# EAGLE design rtc_module (EAGLE 9.6.1)
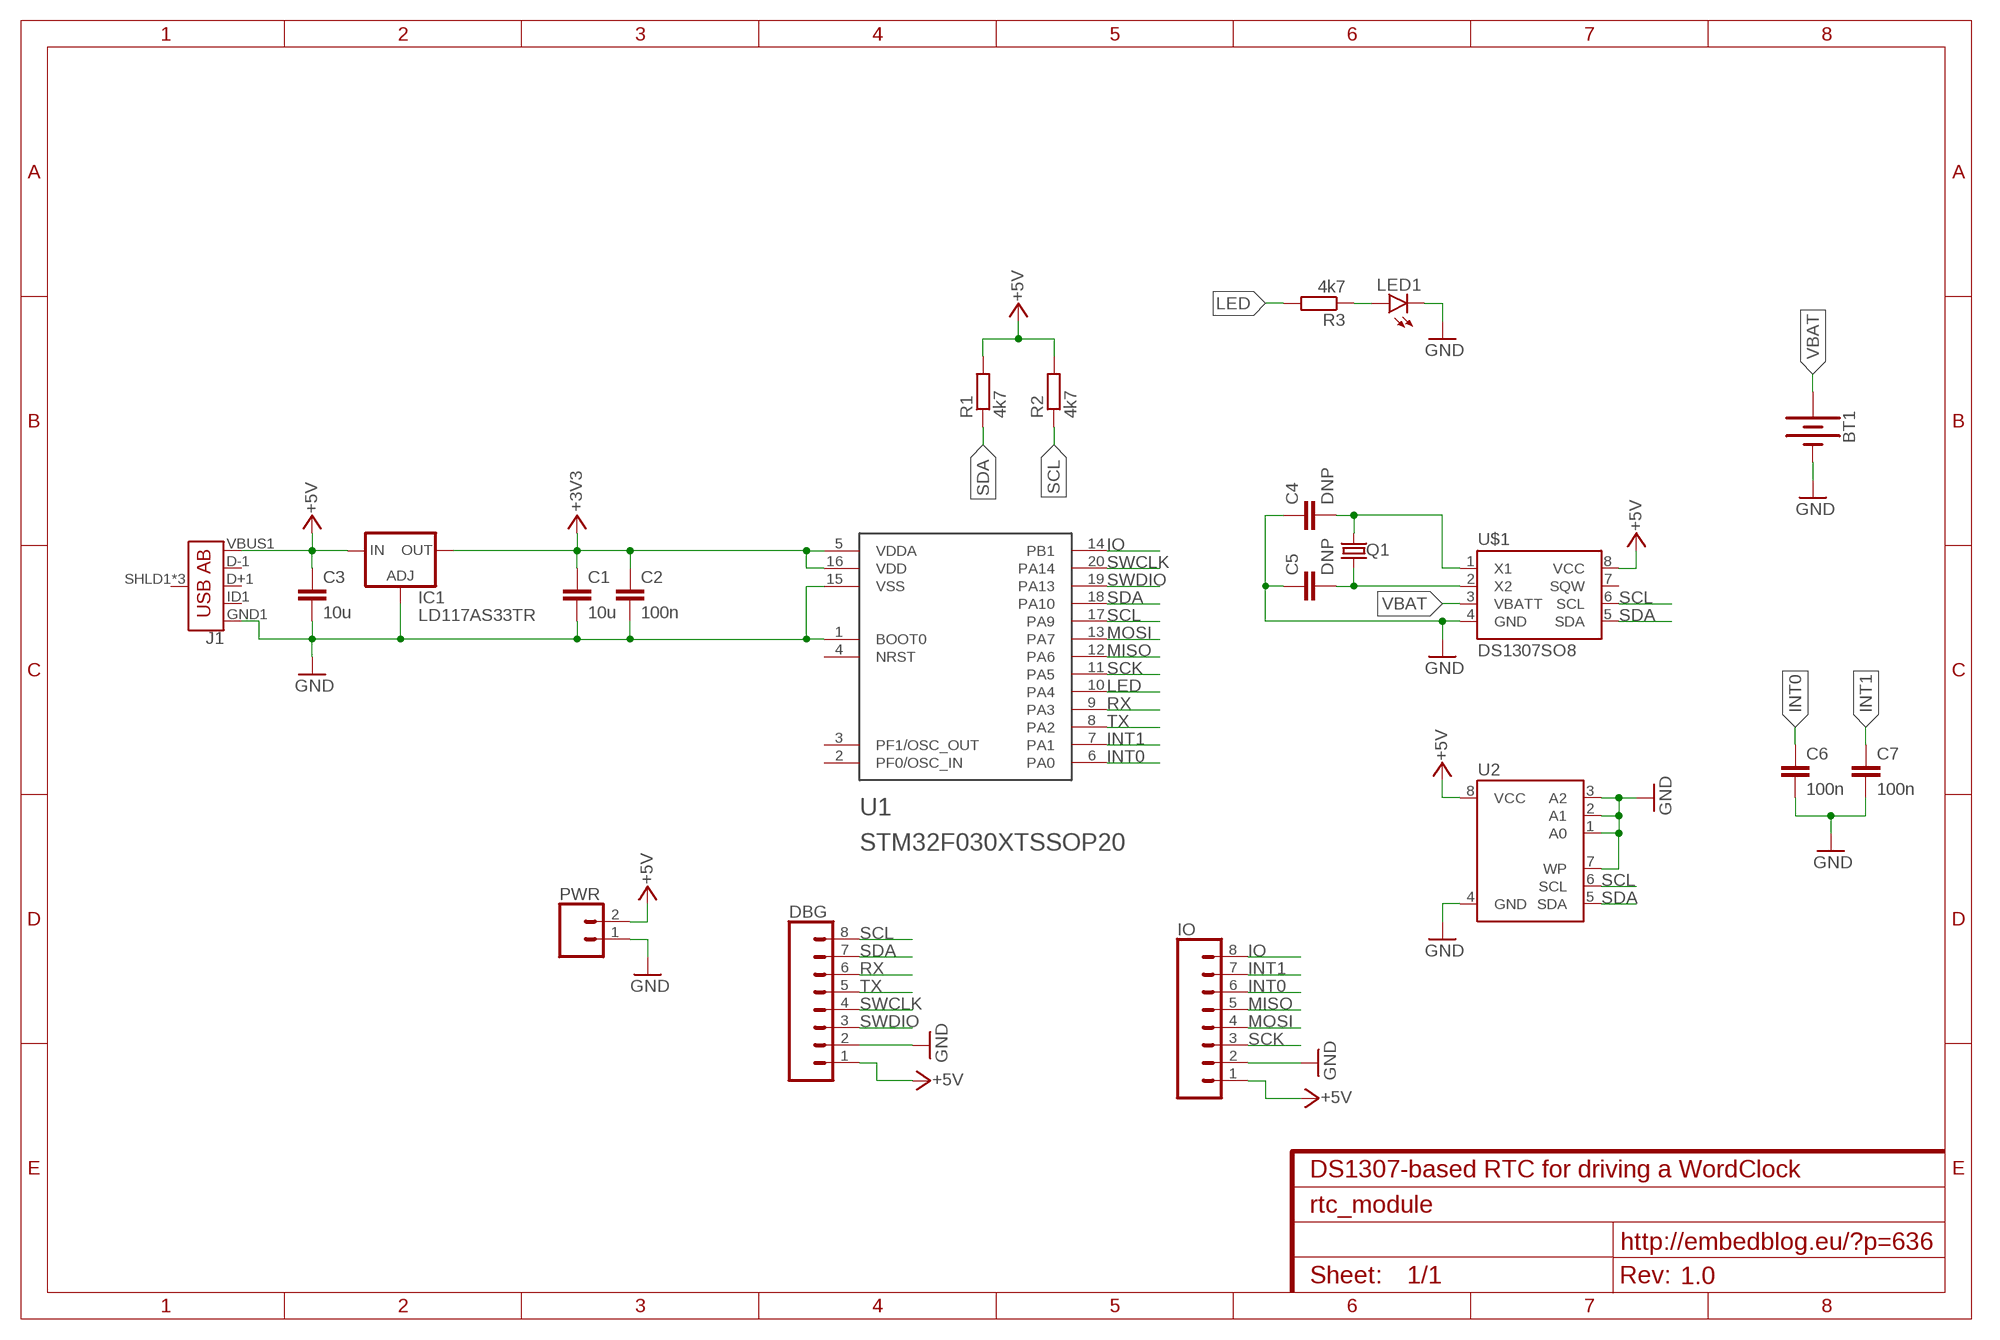
[diagram p0: schematic, sheet 1]
FRAME1 (FRAME-A4L): CNAME: DS1307-based RTC for driving a WordClock; CREVISION: 1.0

## Parts
BT1  BATTERY-20MM_PTH  [BATTCOM_20MM_PTH]
C1  10u  C-EUC1206  [C1206]
C2  100n  C-EUC1206  [C1206]
C3  10u  C-EUC1206  [C1206]
C4  DNP  C-EUC1206  [C1206]
C5  DNP  C-EUC1206  [C1206]
C6  100n  C-EUC1206  [C1206]
C7  100n  C-EUC1206  [C1206]
DBG  CONN_08"  [1X08]
IC1  LD117AS33TR  [SOT223]
IO  CONN_08"  [1X08]
J1  USB_AB_SMT  [USB-AB-MICRO-SMD]
LED1  LEDCHIPLED_1206  [CHIPLED_1206]
PWR  CONN_02PTH3  [1X02_LONGPADS]
Q1  CRYSTALTC38H  [TC38H]
R1  4k7  R-EU_R1206  [R1206]
R2  4k7  R-EU_R1206  [R1206]
R3  4k7  R-EU_R1206  [R1206]
U1  STM32F030XTSSOP20  [TSSOP-20]
U2  24LCXX  [SOIC8]
U$1  DS1307SO8  [SO08]

## Nets
+3V3: C1.1 C2.1 IC1.4(OUT) U1.5(VDDA) U1.16(VDD)
+5V: C3.1 DBG.1 IC1.3(IN) IO.1 J1.VBUS1(VBUS) PWR.2 R1.2 R2.2 U2.8(VCC) U$1.8(VCC)
GND: BT1.2(-) C1.2 C2.2 C3.2 C4.1 C5.1 C6.2 C7.2 DBG.2 IC1.1(ADJ) IO.2 J1.GND1(GND) LED1.C PWR.1 U1.1(BOOT0) U1.15(VSS) U2.1(A0) U2.2(A1) U2.3(A2) U2.4(GND) U2.7(WP) U$1.4(GND)
INT0: C6.1 IO.6 U1.6(PA0)
INT1: C7.1 IO.7 U1.7(PA1)
IO: IO.8 U1.14(PB1)
LED: R3.2 U1.10(PA4)
MISO: IO.5 U1.12(PA6)
MOSI: IO.4 U1.13(PA7)
N$1: C5.2 Q1.1 U$1.2(X2)
N$2: C4.2 Q1.2 U$1.1(X1)
N$4: LED1.A R3.1
RX: DBG.6 U1.9(PA3)
SCK: IO.3 U1.11(PA5)
SCL: DBG.8 R2.1 U1.17(PA9) U2.6(SCL) U$1.6(SCL)
SDA: DBG.7 R1.1 U1.18(PA10) U2.5(SDA) U$1.5(SDA)
SWCLK: DBG.4 U1.20(PA14)
SWDIO: DBG.3 U1.19(PA13)
TX: DBG.5 U1.8(PA2)
VBAT: BT1.1(+) U$1.3(VBATT)
Unconnected: J1.D+1(D+) J1.D-1(D-) J1.ID1(USBID) J1.SHLD1(SHIELD) J1.SHLD2(SHIELD) J1.SHLD3(SHIELD) U1.2(PF0/OSC_IN) U1.3(PF1/OSC_OUT) U1.4(NRST) U$1.7(SQW)

## Notes on the sheet
- http://embedblog.eu/?p=636

## Library data of the parts
BT1 = SparkFun-Batteries:BATTERY: Battery - Single Cell A variety of battery chemistries, sizes, and footprints. Device List: 20MM_PTH - Coin Cell Battery Holder - 20mm (PTH) <https://www.sparkfun.com/products/783> 20MM_PTH_KIT- Coin Cell battery Holder - 20 mm (PTH) <http://www.sparkfun.com/products/783>kit version with special mask 6.8MM_PTH - Coin Cell Battery Holder - 6.8MM(SMD) <https://www.digikey.com/product-detail/en/seiko-instruments/MS621FE-FL11E/728-1057-ND/1889208?WT.srch=1&gclid=CNOQ5a6LzdQCFZS2wAodXCkE0g> 12MM_SMD - Coin Cell Battery Holder - 12mm (SMD) <https://www.sparkfun.com/products/10592> 12MM_PTH - Coin Cell Battery Holder - 12mm (PTH) <https://www.sparkfun.com/products/7948> 20MM_SMD - 20mm Coin Cell Battery Holder (SMD) (2 legs) Used on the Big Time Watch Kit <https://www.sparkfun.com/products/11734> 20MM_SMD_4LEGS - Coin Cell Battery Holder - 20mm (SMD) <https://www.sparkfun.com/products/11892> 20MM_SMD_4LEGS_OVERPASTE - Coin Cell Battery Holder - 20mm (SMD) <https://www.sparkfun.com/products/11892> (Over-paste on the legs) 24.5MM_PTH - Coin Cell Battery Holder - 24.5mm (PTH) <https://www.sparkfun.com/products/8863> 9V - 9V Battery Holder - PC Mount Used on the SparkFun SparkPunk Sound Kit <https://www.sparkfun.com/products/11177> and SparkFun SparkPunk Sequencer Kit <https://www.sparkfun.com/products/12707> 18650 - Battery Holder - 18650 (PTH) <https://www.sparkfun.com/products/13113> AA - Battery Holder - 1xAA (PTH) <https://www.sparkfun.com/products/7949> AAA - Battery Holder - 1xAAA (PTH) <https://www.sparkfun.com/products/12718> AA_KIT - Battery Holder - 1xAA (PTH) <https://www.sparkfun.com/products/7949> Special kit package - pads only have exposed copper on one side of the board. AAA_KIT - Battery Holder - 1xAAA (PTH) <https://www.sparkfun.com/products/12718> Special kit package - pads only have exposed copper on one side of the board.; PROD_ID: BATT-09031; SF_SKU: PRT-00783
C1-C7 = resistor:C-EU: CAPACITOR, European symbol
DBG IO = SparkFun-Connectors:CONN_08: Multi connection point. Often used as Generic Header-pin footprint for 0.1 inch spaced/style header connections On any of the 0.1 inch spaced packages, you can populate with these: Break Away Headers - Straight <https://www.sparkfun.com/products/116> (PRT-00116) Break Away Male Headers - Right Angle <https://www.sparkfun.com/products/553> (PRT-00553) Female Headers <https://www.sparkfun.com/products/115> (PRT-00115) Break Away Headers - Machine Pin <https://www.sparkfun.com/products/117> (PRT-00117) Break Away Female Headers - Swiss Machine Pin <https://www.sparkfun.com/products/743> (PRT-00743) Arduino Stackable Header - 8 Pin <https://www.sparkfun.com/products/9279> (PRT-09279) For SCREWTERMINALS and SPRING TERMINALS visit here: Screw Terimnals on SparkFun.com <https://www.sparkfun.com/search/results?term=Screw+Terminals> (5mm/3.5mm/2.54mm spacing) This device is also useful as a general connection point to wire up your design to another part of your project. Our various solder wires solder well into these plated through hole pads. Hook-Up Wire - Assortment (Stranded, 22 AWG) <https://www.sparkfun.com/products/11375> (PRT-11375) Hook-Up Wire - Assortment (Solid Core, 22 AWG) <https://www.sparkfun.com/products/11367> (PRT-11367) View the entire wire category on our website here <https://www.sparkfun.com/categories/141> Special notes: Molex polarized connector foot print use with SKU : PRT-08231 with associated crimp pins and housings. 1MM SMD Version SKU: PRT-10208 NOTES ON THE VARIANTS LOCK and LOCK_LONGPADS... This footprint was designed to help hold the alignment of a through-hole component (i.e. 6-pin header) while soldering it into place. You may notice that each hole has been shifted either up or down by 0.005 of an inch from it's more standard position (which is a perfectly straight line). This slight alteration caused the pins (the squares in the middle) to touch the edges of the holes. Because they are alternating, it causes a "brace" to hold the component in place. 0.005 has proven to be the perfect amount of "off-center" position when using our standard breakaway headers. Although looks a little odd when you look at the bare footprint, once you have a header in there, the alteration is very hard to notice. Also,if you push a header all the way into place, it is covered up entirely on the bottom side.; PROD_ID: CONN-08438
IC1 = v-reg:LD117A?*: Low drop fixed and adjustable positive voltage regulators 1 A Source: http://www.st.com/stonline/products/literature/ds/7194/ld1117axx.pdf
J1 = SparkFun-Connectors:USB_AB: USB Type AB Micro Connector OTG-compatible. 5 pins, 3 shield pins SparkFun Products: IOIO-OTG <https://www.sparkfun.com/products/13613> SparkFun SAMD21 Mini Breakout <https://www.sparkfun.com/products/13664>; PROD_ID: CONN-11794
LED1 = led:LED: LED OSRAM: - CHIPLED LG R971, LG N971, LY N971, LG Q971, LY Q971, LO R971, LY R971 LH N974, LH R974 LS Q976, LO Q976, LY Q976 LO Q996 - Hyper CHIPLED LW Q18S LB Q993, LB Q99A, LB R99A - SideLED LS A670, LO A670, LY A670, LG A670, LP A670 LB A673, LV A673, LT A673, LW A673 LH A674 LY A675 LS A676, LA A676, LO A676, LY A676, LW A676 LS A679, LY A679, LG A679 - Hyper Micro SIDELED® LS Y876, LA Y876, LO Y876, LY Y876 LT Y87S - SmartLED LW L88C, LW L88S LB L89C, LB L89S, LG L890 LS L89K, LO L89K, LY L89K LS L896, LA L896, LO L896, LY L896 - TOPLED LS T670, LO T670, LY T670, LG T670, LP T670 LSG T670, LSP T670, LSY T670, LOP T670, LYG T670 LG T671, LOG T671, LSG T671 LB T673, LV T673, LT T673, LW T673 LH T674 LS T676, LA T676, LO T676, LY T676, LB T676, LH T676, LSB T676, LW T676 LB T67C, LV T67C, LT T67C, LS T67K, LO T67K, LY T67K, LW E67C LS E67B, LA E67B, LO E67B, LY E67B, LB E67C, LV E67C, LT E67C LW T67C LS T679, LY T679, LG T679 LS T770, LO T770, LY T770, LG T770, LP T770 LB T773, LV T773, LT T773, LW T773 LH T774 LS E675, LA E675, LY E675, LS T675 LS T776, LA T776, LO T776, LY T776, LB T776 LHGB T686 LT T68C, LB T68C - Hyper Mini TOPLED® LB M676 - Mini TOPLED Santana® LG M470 LS M47K, LO M47K, LY M47K Source: http://www.osram.convergy.de LUXEON: - LUMILED® LXK2-PW12-R00, LXK2-PW12-S00, LXK2-PW14-U00, LXK2-PW14-V00 LXK2-PM12-R00, LXK2-PM12-S00, LXK2-PM14-U00 LXK2-PE12-Q00, LXK2-PE12-R00, LXK2-PE12-S00, LXK2-PE14-T00, LXK2-PE14-U00 LXK2-PB12-K00, LXK2-PB12-L00, LXK2-PB12-M00, LXK2-PB14-N00, LXK2-PB14-P00, LXK2-PB14-Q00 LXK2-PR12-L00, LXK2-PR12-M00, LXK2-PR14-Q00, LXK2-PR14-R00 LXK2-PD12-Q00, LXK2-PD12-R00, LXK2-PD12-S00 LXK2-PH12-R00, LXK2-PH12-S00 LXK2-PL12-P00, LXK2-PL12-Q00, LXK2-PL12-R00 Source: www.luxeon.com KINGBRIGHT: KA-3528ASYC Source: www.kingbright.com
PWR = SparkFun-Connectors:CONN_02: Multi connection point. Often used as Generic Header-pin footprint for 0.1 inch spaced/style header connections On any of the 0.1 inch spaced packages, you can populate with these: Break Away Headers - Straight <https://www.sparkfun.com/products/116> (PRT-00116) Break Away Male Headers - Right Angle <https://www.sparkfun.com/products/553> (PRT-00553) Female Headers <https://www.sparkfun.com/products/115> (PRT-00115) Break Away Headers - Machine Pin <https://www.sparkfun.com/products/117> (PRT-00117) Break Away Female Headers - Swiss Machine Pin <https://www.sparkfun.com/products/743> (PRT-00743) For SCREWTERMINALS and SPRING TERMINALS visit here: Screw Terimnals on SparkFun.com <https://www.sparkfun.com/search/results?term=Screw+Terminals> (5mm/3.5mm/2.54mm spacing) This device is also useful as a general connection point to wire up your design to another part of your project. Our various solder wires solder well into these plated through hole pads. Hook-Up Wire - Assortment (Stranded, 22 AWG) <https://www.sparkfun.com/products/11375> (PRT-11375) Hook-Up Wire - Assortment (Solid Core, 22 AWG) <https://www.sparkfun.com/products/11367> (PRT-11367) View the entire wire category on our website here <https://www.sparkfun.com/categories/141> Special notes: Molex polarized connector foot print use with: PRT-08233 with associated crimp pins and housings. 2.54_SCREWTERM for use with PRT-10571. 3.5mm Screw Terminal footprints for PRT-08084 5mm Screw Terminal footprints for use with PRT-08432
Q1 = crystal:CRYSTAL: CRYSTAL; OC_FARNELL: unknown; OC_NEWARK: unknown
R1-R3 = resistor:R-EU_: RESISTOR, European symbol
U1 = stm32f030x:STM32F030X
U2 = m-pad-2.1:24LCXX: Serial I2C bus eeprom
U$1 = SparkFun-FreqCtrl:DS1307: I2C real-time clock with battery backup.

## Board
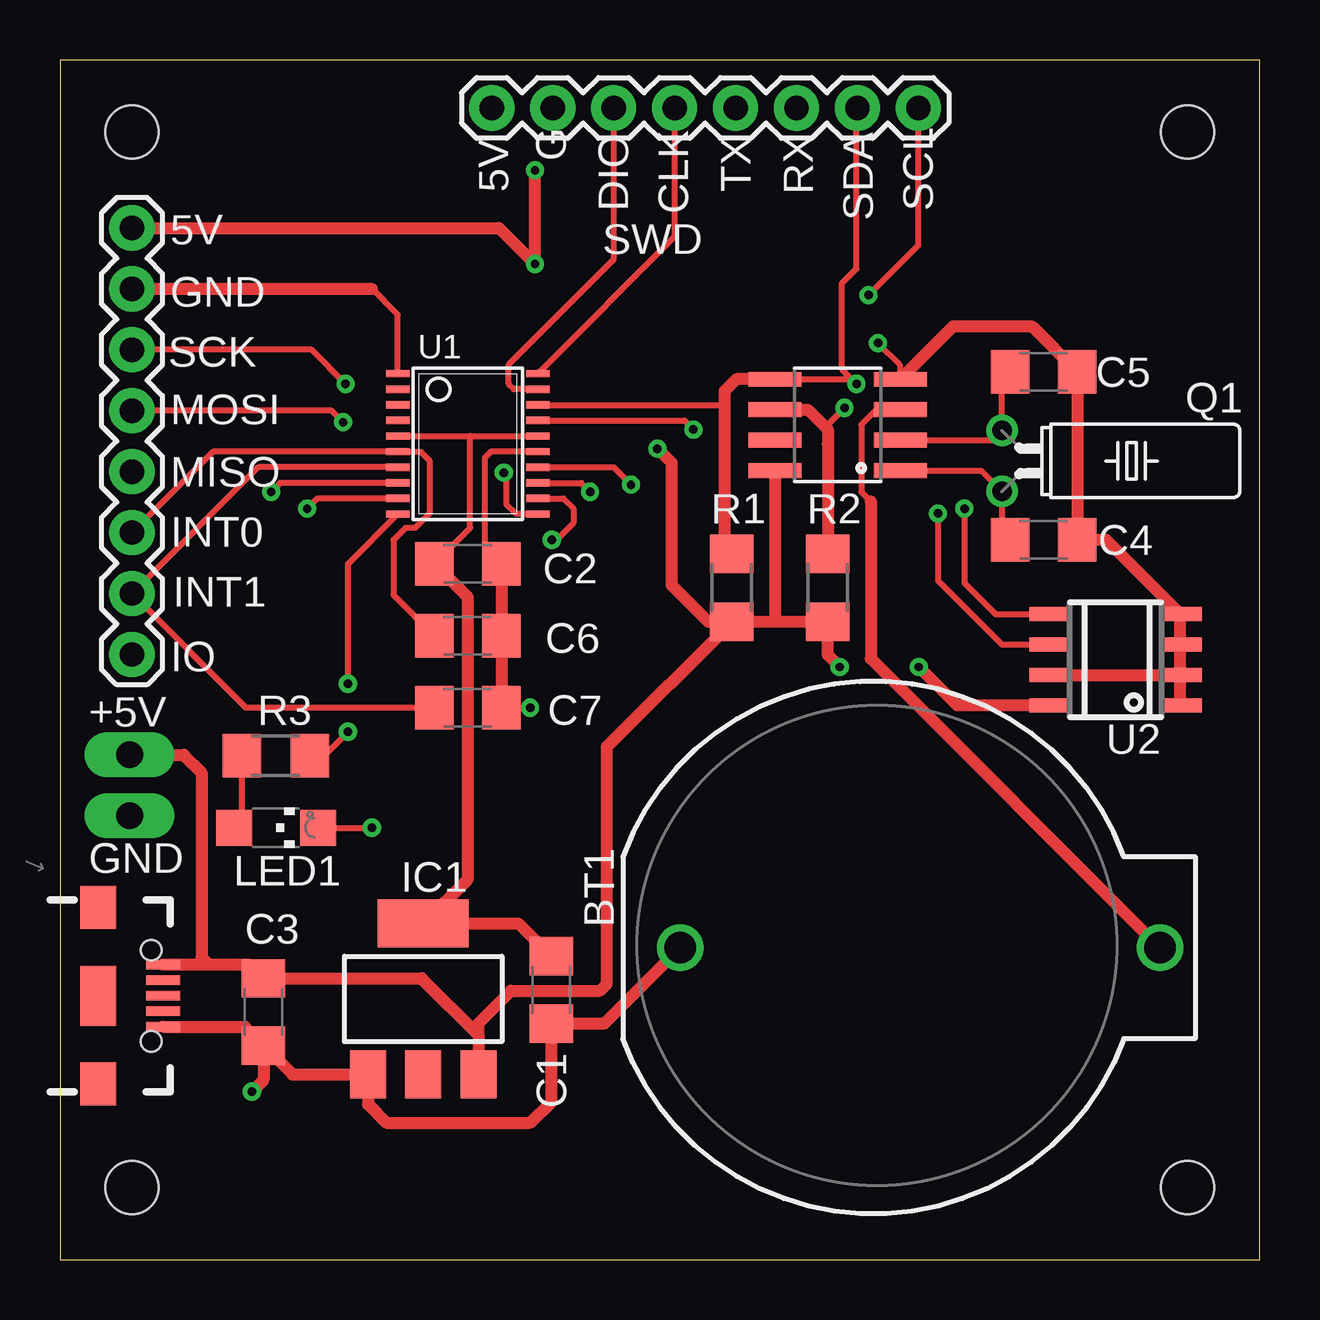
[diagram p1: board, top side]
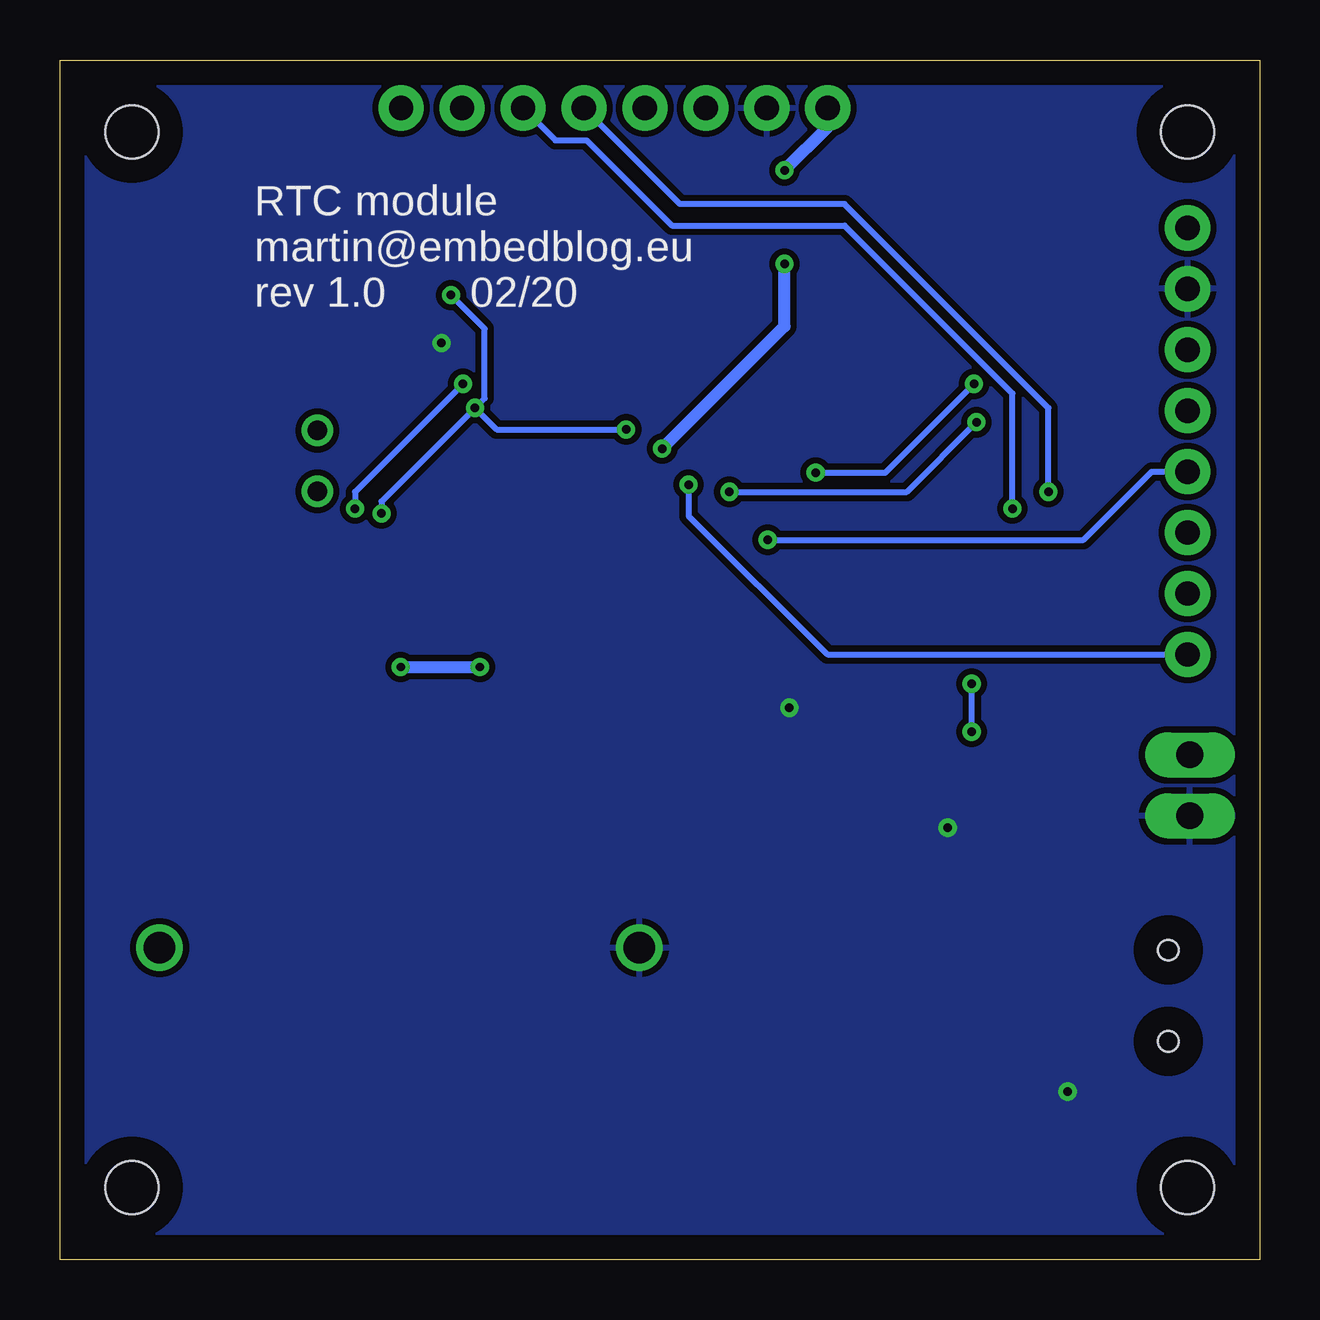
[diagram p2: board, bottom side, seen from below]

Size 50 x 50 mm. Coordinates in mm from the lower left corner, seen from the top.
Outline: 0,0 50,0 50,50 0,50 0,0
Copper layers (1*16): Top 0.035mm / dielectric 1.5mm / Bottom 0.035mm
Design rules "default": minimum track width 6mil, minimum drill 0.35mm, track to track 6mil, track to pad 6mil, pad to pad 6mil, via to via 6mil, smd to smd 6mil, copper to edge 40mil, drill to drill 6mil, minimum pad ring 10mil, minimum via ring 8mil, stop-mask expansion 4mil, vias tented up to drill 0mil, thermal gap 10mil
Holes 2.2 mm at 3,3 47,3 3,47 47,47

### Footprints (pad centres in the part's own frame; a part is rotated, then mirrored left to right if it is on the bottom)
BATTCOM_20MM_PTH = drill 1.3: 1 11.85,0; 2 -8.15,0
C1206 = smd 1.6 x 1.8: 1 -1.4,0; 2 1.4,0
1X08 = drill 1.016 pad 1.88: 1 0,0; 2 2.54,0; 3 5.08,0; 4 7.62,0; 5 10.16,0; 6 12.7,0; 7 15.24,0; 8 17.78,0
SOT223 = smd 1.5 x 2: 1 -2.3,-3.15; 2 0,-3.15; 3 2.3,-3.15 | smd 3.8 x 2: 4 0,3.15
USB-AB-MICRO-SMD = smd 1.4 x 0.4: D+1 2.7,0; D-1 2.7,0.65; GND1 2.7,-1.3; ID1 2.7,-0.65; VBUS1 2.7,1.3 | smd 1.5 x 1.8: SHLD1 0,-3.68; SHLD2 0,3.68 | smd 1.5 x 2.5: SHLD3 0,0 | hole 0.85: 2.2,1.9; 2.2,-1.9
CHIPLED_1206 = smd 1.5 x 1.5: A 0,-1.75; C 0,1.75
1X02_LONGPADS = drill 1.118 pad 1.88 long: 1 0,0; 2 2.54,0
TC38H = drill 0.813: 1 -1.27,0; 2 1.27,0
R1206 = smd 1.6 x 1.803: 1 -1.422,0; 2 1.422,0
TSSOP-20 = smd 0.305 x 0.991: 1 -2.925,-2.918; 2 -2.275,-2.918; 3 -1.625,-2.918; 4 -0.975,-2.918; 5 -0.325,-2.918; 6 0.325,-2.918; 7 0.975,-2.918; 8 1.625,-2.918; 9 2.275,-2.918; 10 2.925,-2.918; 11 2.925,2.918; 12 2.275,2.918; 13 1.625,2.918; 14 0.975,2.918; 15 0.325,2.918; 16 -0.325,2.918; 17 -0.975,2.918; 18 -1.625,2.918; 19 -2.275,2.918; 20 -2.925,2.918
SOIC8 = smd 0.6 x 1.8: 1 -1.905,-2.7; 2 -0.635,-2.7; 3 0.635,-2.7; 4 1.905,-2.7; 5 1.905,2.7; 6 0.635,2.7; 7 -0.635,2.7; 8 -1.905,2.7
SO08 = smd 0.61 x 2.21: 1 -1.905,-2.616; 2 -0.635,-2.616; 3 0.635,-2.616; 4 1.905,-2.616; 5 1.905,2.616; 6 0.635,2.616; 7 -0.635,2.616; 8 -1.905,2.616

### Placement (x,y rotation side)
BT1  34,13 0 top
C1  20.48,11.24 270 top
C2  17,29 0 top
C3  8.48,10.32 270 top
C4  41,30 180 top
C5  41,37 180 top
C6  17,26 0 top
C7  17,23 0 top
DBG  18,48 0 top
IC1  15.14,10.86 0 top
IO  3,43 270 top
J1  1.6,11 0 top
LED1  9,18 270 top
PWR  2.9,18.5 90 top
Q1  39.27,33.29 270 top
R1  28,28 270 top
R2  32,28 270 top
R3  9,21 0 top
U1  17,34 270 top
U2  44,25 90 top
U$1  32.41,34.79 90 top

### Tracks (layer width: path | path; a pad name or v marks a point on that pad's centre or on a via)
+3V3
  Top 0.254: U1.5 17.1,34.33 | 17.1,34.33 U1.16 | C2.1 17.1,30.5 17.1,34.33
  Top 0.508: C1.1 19.11,14.01 IC1.4 17,15.87 17,27.6 C2.1
+5V  (via drill 0.35)
  Top 0.508: J1.VBUS1 6.2,12.3 | 6.2,12.3 7.9,12.3 C3.1 15.08,11.72 17.44,9.36 | 17.44,9.36 IC1.3 | 29.8,26.58 R2.2 32,25.2 v32.5,24.7 | 29.8,26.58 R1.2 | U$1.8 29.79,26.58 29.8,26.58 | 17.44,9.36 17.44,9.84 18.8,11.2 22.5,11.2 22.8,11.5 22.8,21.38 R1.2 | R1.2 27.02,26.58 25.5,28.1 25.5,33.2 v24.9,33.8 | v19.8,45.4 v19.8,41.5 18.3,43 IO.1 | U2.8 37.41,23.09 v35.8,24.7 | PWR.2 5.16,21.04 5.9,20.3 5.9,12.6 6.2,12.3
  Bottom 0.508: v24.9,33.8 19.8,38.9 v19.8,41.5 | v19.8,45.4 18,47.2 DBG.1 | v35.8,24.7 v32.5,24.7
GND  (via drill 0.35)
  Top 0.254: U1.15 17.98,33.67 17.7,33.4 17.7,29.7 C2.2 | U1.1 14.08,39.38 13,40.46 | LED1.C v13,18 | C7.2 v19.6,23 | U$1.4 35.03,37.27 v34.1,38.2
  Top 0.508: J1.GND1 7.7,9.7 C3.2 | C3.2 9.69,7.71 IC1.1 12.84,6.46 13.6,5.7 19.6,5.7 20.48,6.58 C1.2 22.69,9.84 BT1.2 | C2.2 C6.2 C7.2 | IO.2 13,40.46 | U$1.4 37.23,38.9 40.5,38.9 C5.1 C4.1 43.6,30 U2.4 U2.3 U2.2 | C3.2 8.48,7.48 v8,7 | U2.1 U2.2 | U2.7 U2.2
  pour Bottom (isolate 0.254): 0,50 50,50 50,0 0,0
INT0
  Top 0.254: IO.6 6.38,33.67 U1.6 15.03,33.67 15.4,33.3 15.4,31.1 14.8,30.5 14.4,30.5 13.9,30 13.9,27.7 C6.1
INT1
  Top 0.254: U1.7 8.27,33.02 IO.7 7.76,23 C7.1
IO  (via drill 0.35)
  Top 0.254: U1.14 23.07,33.02 v23.8,32.3
  Bottom 0.254: v23.8,32.3 23.8,31 18.02,25.22 IO.8
LED  (via drill 0.35)
  Top 0.254: R3.2 11,21 v12,22 | v12,24 12,28.99 U1.10
  Bottom 0.254: v12,22 v12,24
MISO  (via drill 0.35)
  Top 0.254: U1.12 20.98,31.73 21.4,31.3 21.4,30.7 20.7,30 v20.5,30
  Bottom 0.254: IO.5 4.5,32.84 7.34,30 v20.5,30
MOSI  (via drill 0.35)
  Top 0.254: U1.13 21.73,32.38 v22.1,32 | v11.8,34.9 11.32,35.38 IO.4
  Bottom 0.254: v22.1,32 14.7,32 v11.8,34.9
N$1
  Top 0.254: U$1.2 38.87,34.16 Q1.1 39.27,36.67 C5.2
N$2
  Top 0.254: U$1.1 38.41,32.88 Q1.2 39.27,30.33 C4.2
N$4
  Top 0.254: R3.1 7.58,18.33 LED1.A
RX  (via drill 0.35)
  Top 0.254: U1.9 10.72,31.73 v10.3,31.3
  Bottom 0.254: v10.3,31.3 10.3,36.1 17.3,43.1 24.5,43.1 28.05,46.65 29.35,46.65 DBG.6
SCK  (via drill 0.35)
  Top 0.254: U1.11 19.02,31.07 18.6,31.5 18.6,32.7 v18.5,32.8 | v11.9,36.5 10.48,37.92 IO.3
  Bottom 0.254: v18.5,32.8 15.6,32.8 v11.9,36.5
SCL  (via drill 0.35)
  Top 0.254: 32,34 32,34.8 v32.7,35.5 | U1.17 26.02,34.98 v26.4,34.6 | v36.6,31.1 36.6,28.3 39.27,25.64 U2.6 | v33.7,40.2 35.78,42.28 DBG.8
  Top 0.508: U$1.6 31.18,35.42 32,34.6 32,34 R2.1
  Bottom 0.254: v32.7,35.5 31.8,34.6 v26.4,34.6 | v32.7,35.5 36.6,31.6 v36.6,31.1 | v32.7,35.5 32.3,35.9 32.3,38.8 v33.7,40.2
SDA  (via drill 0.35)
  Top 0.254: U1.18 27.68,35.62 27.7,35.6 | U$1.5 33.01,36.7 v33.2,36.5 32.6,37.1 32.6,40.7 33.2,41.3 33.2,47.96 DBG.7 | v37.7,31.3 37.7,28.2 38.99,26.91 U2.5
  Top 0.508: U$1.5 28.2,36.7 27.7,36.2 27.7,35.6 27.7,29.72 R1.1
  Bottom 0.254: v33.2,36.5 37.7,32 v37.7,31.3
SWCLK
  Top 0.254: U1.20 25.62,42.63 DBG.4
SWDIO
  Top 0.254: U1.19 18.93,36.27 18.7,36.5 18.7,37.3 23.08,41.68 DBG.3
TX  (via drill 0.35)
  Top 0.254: U1.8 9.18,32.38 v8.8,32
  Bottom 0.254: v8.8,32 8.8,35.5 17.3,44 24,44 24.16,44 DBG.5
VBAT
  Top 0.254: U$1.3 34.02,35.42 33.4,34.8 33.4,32 33.8,31.6
  Top 0.508: 33.8,31.6 33.8,25.05 BT1.1

### Text on the board
tPlace: G | 5V | DIO | CLK | TX | RX | SCL | SDA | 5V | SWD | GND | SCK | MOSI | MISO | INT0 | INT1 | IO | +5V | GND
bPlace: RTC module / martin@embedblog.eu / rev 1.0 02/20